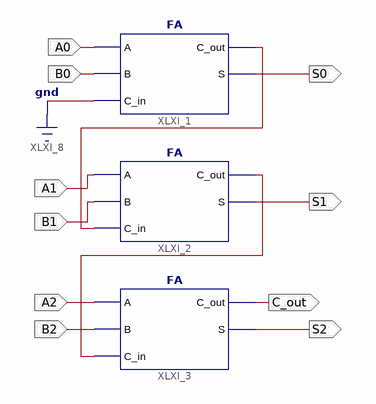
[diagram p0: schematic sheet 1]
// Xilinx ISE schematic RCA.sch (spartan3e) as structural Verilog: 3 symbols, 10 ports
module RCA (
  input  A0,
  input  B0,
  input  A1,
  input  B1,
  input  A2,
  input  B2,
  output S0,
  output S1,
  output S2,
  output C_out
);

  wire XLXN_5, XLXN_7;

  FA XLXI_1 (.A(A0), .B(B0), .C_in(1'b0), .C_out(XLXN_5), .S(S0));
  FA XLXI_2 (.A(A1), .B(B1), .C_in(XLXN_5), .C_out(XLXN_7), .S(S1));
  FA XLXI_3 (.A(A2), .B(B2), .C_in(XLXN_7), .C_out(C_out), .S(S2));
endmodule
